# EasyEDA Pro project CH32V203 DOUBLE-FOC.epro, board PCB1
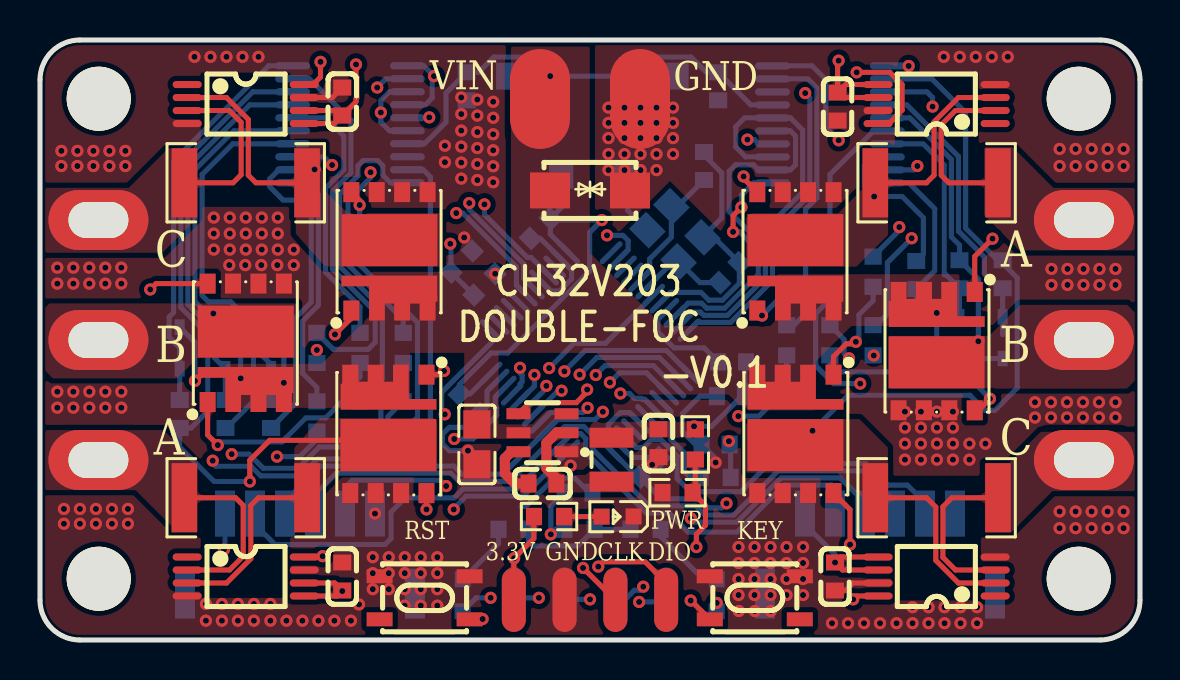
[diagram p2: board, top side]
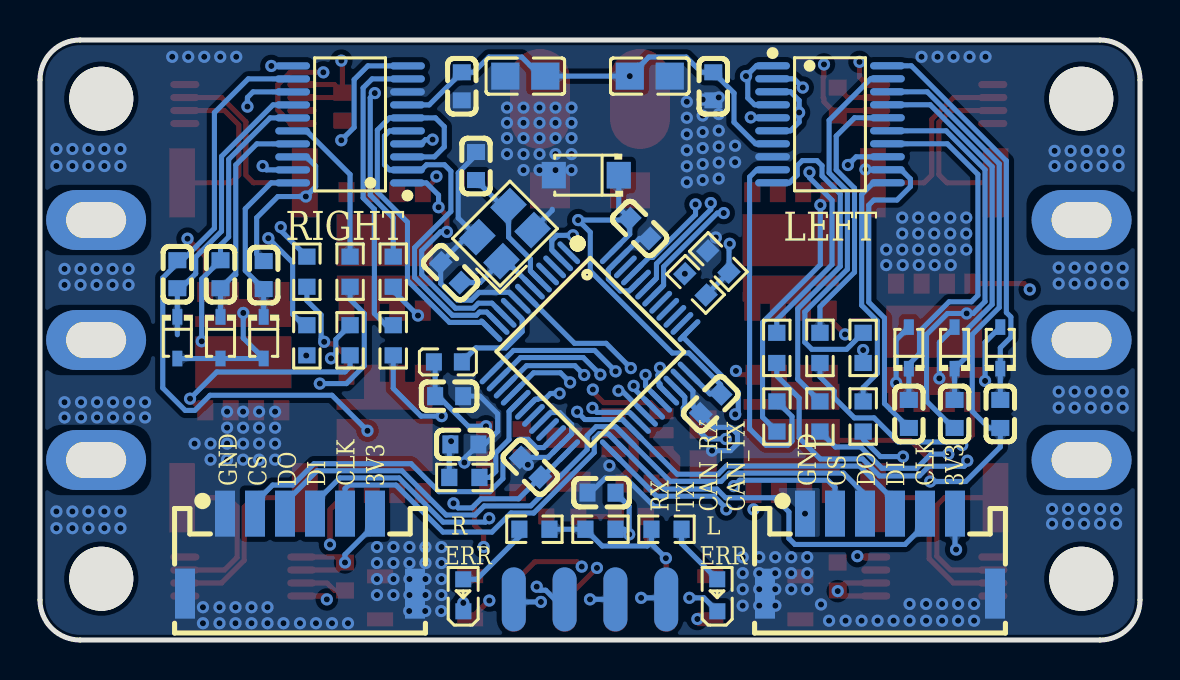
[diagram p3: board, bottom side, seen from below]

Outline 55 x 30 mm; copper layers: Top Layer, Inner1, Inner2, Bottom Layer. Coordinates in mm from the lower left corner of the outline.
Outline path: 0,28 0,2 arc(0.59,0.59) 2,0 53,0 arc(54.41,0.59) 55,2 55,28 arc(54.41,29.41) 53,30 2,30 arc(0.59,29.41) 0,28
Stack: Top Layer 0.035mm 外层铜厚1oz / Dielectric1 0.2104mm 7628 RC49% 8.6mil / Inner1 0.0152mm 内层铜厚 / Dielectric2 1.065mm 1.1mm H/HOZ Copper / Inner2 0.0152mm 内层铜厚 / Dielectric3 0.2104mm 7628 RC49% 8.6mil / Bottom Layer 0.035mm 外层铜厚1oz

## Design rules (mm)
template: 自定义配置
spacing copperThickness1oz (default): track to track 0.102, other pairs 0.152 to 0.3
spacing copperThickness2oz: track to track 0.203, other pairs 0.152 to 0.3
track width copperThickness1oz (default): min 0.127, default 0.254, max 2.54
track width copperThickness2oz: min 0.203, default 0.254, max 2.54
differential pair differentialPair (default): width min 0.127, default 0.254, max 2.54; gap min 0.152, default 0.152
via viaSize (default): diameter min 0.5, default 0.61, max 10; hole min 0.3, default 0.305, max 6.3

## Placement (name value [footprint] x y rotation side)
C1  20pF  [C0603]  33.2 23.7 90 bottom
C2  100nF  [C0603]  39.75 3.17 90 top
C3  100nF  [C0603]  34.54 12.19 0 bottom
C4  20pF  [C0603]  34.47 18.36 45 bottom
C8  100nF  [C0603]  21.46 11.81 135 bottom
C9  100nF  [C0603]  25.02 20.57 45 bottom
C10  100nF  [C0603]  30.48 8.64 225 bottom
C15  100nF  [C0603]  26.92 7.37 180 bottom
C19  100nF  [C0603]  25.12 7.82 180 top
C20  22uF  [C0603]  30.92 9.84 90 top
C21  10uF  [C0805]  21.84 9.78 90 top
C25  100nF  [C0603]  33.91 27.69 90 bottom
C26  22uF  [C0805]  24.51 28.19 0 bottom
C27  100nF  [C0603]  6.98 11.3 90 bottom
C28  100nF  [C0603]  9.27 11.3 90 bottom
C29  100nF  [C0603]  11.56 11.3 90 bottom
C30  100nF  [C0603]  21.34 27.69 90 bottom
C31  22uF  [C0805]  30.73 28.19 180 bottom
C32  100nF  [C0603]  43.81 18.25 270 bottom
C33  100nF  [C0603]  45.97 18.29 270 bottom
C34  100nF  [C0603]  48.13 18.29 270 bottom
C35  100nF  [C0603]  33.78 9.78 0 bottom
C36  100nF  [C0603]  15.11 3.17 270 top
C37  100nF  [C0603]  15.11 26.92 270 top
C38  100nF  [C0603]  39.88 26.67 90 top
CN2  -  [1x4P排针贴片]  27.5 2.03 180 bottom
CN3  -  [1x4P排针贴片]  27.5 2 0 top
CN4  -  [电源接口]  27.5 27.05 0 top
CN5  -  [无刷电机接口]  2.92 15 90 top
CN6  -  [无刷电机接口]  52.19 15 270 top
D1  SMF3.3  [SOD-123FL_L3.0-W1.9-LS3.7-FD]  27.69 23.24 180 bottom
D2  B5819WS  [SOD-323_L1.7-W1.3-LS2.5-FD]  9.27 14.61 270 bottom
D3  B5819WS  [SOD-323_L1.7-W1.3-LS2.5-FD]  11.56 14.61 270 bottom
D4  B5819WS  [SOD-323_L1.7-W1.3-LS2.5-FD]  6.98 14.61 270 bottom
D5  B5819WS  [SOD-323_L1.7-W1.3-LS2.5-FD]  43.81 15.11 90 bottom
D6  B5819WS  [SOD-323_L1.7-W1.3-LS2.5-FD]  45.97 15.11 90 bottom
D7  B5819WS  [SOD-323_L1.7-W1.3-LS2.5-FD]  48.13 15.11 90 bottom
D8  SMAJ16CA  [SMA_L4.4-W2.6-LS5.0-BI]  27.5 22.48 180 top
L1  BLM18PG121SN1D  [L0603]  34.61 13.91 180 bottom
L3  2.2uH  [IND-SMD_L2.5-W2.0_MHCHL2520]  28.57 9.02 90 top
LED1  红  [LED0603-RD_RED]  28.88 6.17 180 top
LED2  蓝  [LED0603-RD_RED]  21.13 2.24 90 bottom
LED3  蓝  [LED0603-RD_RED]  33.84 2.24 90 bottom
OSC1  CH32V203C8T6TR  [LQFP-48_L7.0-W7.0-P0.50-LS9.0-BL]  27.5 14.41 315 bottom
Q1  RUH30J51M  [DFN-8_L6.0-W5.0-P1.27_AON6938]  17.42 10.31 180 top
Q2  RUH30J51M  [DFN-8_L6.0-W5.0-P1.27_AON6938]  10.29 14.86 0 top
Q3  RUH30J51M  [DFN-8_L6.0-W5.0-P1.27_AON6938]  17.47 19.43 0 top
Q4  RUH30J51M  [DFN-8_L6.0-W5.0-P1.27_AON6938]  37.77 19.43 0 top
Q5  RUH30J51M  [DFN-8_L6.0-W5.0-P1.27_AON6938]  44.83 14.44 180 top
Q6  RUH30J51M  [DFN-8_L6.0-W5.0-P1.27_AON6938]  37.77 10.31 180 top
R1  4.7Ω  [R0603]  13.84 11.18 270 bottom
R2  4.7Ω  [R0603]  13.84 14.61 270 bottom
R3  4.7Ω  [R0603]  16 11.18 270 bottom
R4  4.7Ω  [R0603]  16 14.61 270 bottom
R5  4.7Ω  [R0603]  18.15 11.18 270 bottom
R6  4.7Ω  [R0603]  18.16 14.61 270 bottom
R11  10kΩ  [R0603]  26.98 5.54 0 bottom
R14  33.2kΩ  [R0603]  32.77 9.78 90 top
R15  10kΩ  [R0603]  31.88 7.37 0 top
R16  4.7Ω  [R0603]  41.66 14.99 270 bottom
R17  4.7Ω  [R0603]  37.34 18.42 270 bottom
R18  4.7Ω  [R0603]  39.5 14.99 270 bottom
R19  4.7Ω  [R0603]  39.5 18.42 270 bottom
R20  4.7Ω  [R0603]  37.34 14.99 270 bottom
R21  4.7Ω  [R0603]  41.66 18.42 270 bottom
R22  4.7kΩ  [R0603]  25.45 6.17 180 top
R23  4.7kΩ  [R0603]  23.68 5.54 0 bottom
R24  10kΩ  [R0603]  21.08 18.92 225 bottom
R25  100Ω  [R0603]  33.78 8.13 0 bottom
R26  33.2kΩ  [R0603]  22.22 17.78 45 bottom
R27  10mΩ  [R2512]  10.29 7.11 180 top
R28  10mΩ  [R2512]  10.29 22.86 0 top
R29  10mΩ  [R2512]  44.83 22.86 0 top
R30  10mΩ  [R2512]  44.83 7.11 180 top
R31  4.7kΩ  [R0603]  30.28 5.54 180 bottom
SCREW1  -  [M3螺丝]  3 27 0 top
SCREW2  -  [M3螺丝]  3 3 0 top
SCREW3  -  [M3螺丝]  52 27 0 top
SCREW4  -  [M3螺丝]  52 3 0 top
SW1  TS-1089S-02526  [SW-SMD_4P-L4.2-W3.3-P2.15-LS5.1]  19.23 2.11 180 top
SW2  TS-1089S-02526  [SW-SMD_4P-L4.2-W3.3-P2.15-LS5.1]  35.74 2.11 180 top
U1  INA240A2PWR  [TSSOP-8_L4.4-W3.0-P0.65-LS6.4-BL]  10.29 3.17 270 top
U2  INA240A2PWR  [TSSOP-8_L4.4-W3.0-P0.65-LS6.4-BL]  10.29 26.8 270 top
U3  ZX-ZH1.5-6PWT  [CONN-SMD_6P-P1.50_ZX-ZH1.5-6PWT]  42 4.32 180 bottom
U4  ZX-ZH1.5-6PWT  [CONN-SMD_6P-P1.50_ZX-ZH1.5-6PWT]  13 4.32 180 bottom
U5  TPS563201DDCT  [TSOT-23-6_L2.9-W1.6-P0.95-LS2.8-BL]  25.12 10.36 90 top
U6  EG2133  [TSSOP-20_L6.5-W4.4-P0.65-LS6.4-BL]  15.5 25.79 270 bottom
U7  EG2133  [TSSOP-20_L6.5-W4.4-P0.65-LS6.4-BL]  39.5 25.78 90 bottom
U8  INA240A2PWR  [TSSOP-8_L4.4-W3.0-P0.65-LS6.4-BL]  44.83 26.8 90 top
U9  INA240A2PWR  [TSSOP-8_L4.4-W3.0-P0.65-LS6.4-BL]  44.83 3.17 90 top
X4  8MHz  [CRYSTAL-SMD_4P-L3.2-W2.5-BL]  31.75 20.32 135 bottom

## Footprints (pads in the part's own frame, mm; a bottom-side part is the same pattern mirrored in y, then rotated)
1x4P排针贴片
  oval 1.2x3.2 smd: 1(3.81,0) 2(1.27,0) 3(-1.27,0) 4(-3.81,0)
C0603
  rect 0.8x0.9 smd: 1(-0.7,0) 2(0.7,0)
C0805
  rect 1.41x1.35 smd: 1(-1,0) 2(1,0)
CONN-SMD_6P-P1.50_ZX-ZH1.5-6PWT
  rect 1x2.3 smd: 1(-3.75,2) 2(-2.25,2) 3(-0.75,2) 4(0.75,2) 5(2.25,2) 6(3.75,2)
  rect 1x2.5 smd: 7(5.75,-2) 8(-5.75,-2)
CRYSTAL-SMD_4P-L3.2-W2.5-BL
  rect 1.4x1.2 smd: 1(-1.1,-0.85) 2(1.1,-0.85) 3(1.1,0.85) 4(-1.1,0.85)
DFN-8_L6.0-W5.0-P1.27_AON6938
  rect 0.8x1 smd: 1(-1.905,-2.96) 3(1.905,2.96) 4(0.635,2.96) 5(-0.635,2.96) 6(-1.905,2.96)
  custom 4.8x2.25 smd: 2(-0.005,-1.91)
  rect 4.8x2.6 smd: 7(0,0.56)
IND-SMD_L2.5-W2.0_MHCHL2520
  rect 1x2.2 smd: 1(-1.1,0) 2(1.1,0)
L0603
  rect 0.8x0.864 smd: 1(-0.7,0) 2(0.7,0)
LED0603-RD_RED
  rect 0.8x0.8 smd: 1(-0.799,-0.004) 2(0.799,0.004)
LQFP-48_L7.0-W7.0-P0.50-LS9.0-BL
  oval 0.27x1.5 smd: 1(-2.75,-4.25) 2(-2.25,-4.25) 3(-1.75,-4.25) 4(-1.25,-4.25) 5(-0.75,-4.25) 6(-0.25,-4.25) 7(0.25,-4.25) 8(0.75,-4.25) 9(1.25,-4.25) 10(1.75,-4.25) 11(2.25,-4.25) 12(2.75,-4.25) 25(2.75,4.25) 26(2.25,4.25) 27(1.75,4.25) 28(1.25,4.25) 29(0.75,4.25) 30(0.25,4.25) 31(-0.25,4.25) 32(-0.75,4.25) 33(-1.25,4.25) 34(-1.75,4.25) 35(-2.25,4.25) 36(-2.75,4.25)
  oval 1.5x0.27 smd: 13(4.25,-2.75) 14(4.25,-2.25) 15(4.25,-1.75) 16(4.25,-1.25) 17(4.25,-0.75) 18(4.25,-0.25) 19(4.25,0.25) 20(4.25,0.75) 21(4.25,1.25) 22(4.25,1.75) 23(4.25,2.25) 24(4.25,2.75) 37(-4.25,2.75) 38(-4.25,2.25) 39(-4.25,1.75) 40(-4.25,1.25) 41(-4.25,0.75) 42(-4.25,0.25) 43(-4.25,-0.25) 44(-4.25,-0.75) 45(-4.25,-1.25) 46(-4.25,-1.75) 47(-4.25,-2.25) 48(-4.25,-2.75)
M3螺丝
  round 3.2 hole 3.2: 1(-0.064,0.064)
R0603
  rect 0.806x0.864 smd: 1(-0.753,0) 2(0.753,0)
R2512
  rect 1.282x3.456 smd: 1(-3.067,0) 2(3.067,0)
SMA_L4.4-W2.6-LS5.0-BI
  rect 2x1.8 smd: 1(-2,0) 2(2,0)
SOD-123FL_L3.0-W1.9-LS3.7-FD
  rect 1.208x1.33 smd: 1(-1.624,0) 2(1.624,0)
SOD-323_L1.7-W1.3-LS2.5-FD
  rect 0.78x0.5 smd: 1(-1.04,0) 2(1.04,0)
SW-SMD_4P-L4.2-W3.3-P2.15-LS5.1
  rect 1.3x0.7 smd: 1(-2.25,1.075) 2(2.25,1.075) 3(-2.25,-1.075) 4(2.25,-1.075)
TSOT-23-6_L2.9-W1.6-P0.95-LS2.8-BL
  rect 0.55x1.2 smd: 1(-0.95,-1.2) 2(0,-1.2) 3(0.95,-1.2) 4(0.95,1.2) 5(0,1.2) 6(-0.95,1.2)
TSSOP-8_L4.4-W3.0-P0.65-LS6.4-BL
  oval 0.353x1.454 smd: 1(-0.975,-2.927) 2(-0.325,-2.927) 3(0.325,-2.927) 4(0.975,-2.927) 5(0.975,2.927) 6(0.325,2.927) 7(-0.325,2.927) 8(-0.975,2.927)
TSSOP-20_L6.5-W4.4-P0.65-LS6.4-BL
  oval 0.364x1.742 smd: 1(-2.925,-2.871) 2(-2.275,-2.871) 3(-1.625,-2.871) 4(-0.975,-2.871) 5(-0.325,-2.871) 6(0.325,-2.871) 7(0.975,-2.871) 8(1.625,-2.871) 9(2.275,-2.871) 10(2.925,-2.871) 11(2.925,2.871) 12(2.275,2.871) 13(1.625,2.871) 14(0.975,2.871) 15(0.325,2.871) 16(-0.325,2.871) 17(-0.975,2.871) 18(-1.625,2.871) 19(-2.275,2.871) 20(-2.925,2.871)
无刷电机接口
  rrect 3x5 hole 1.8x3: 1(-6,0) 2(0,0) 3(6,0)
电源接口
  rrect 3x5 smd: 1(-2.5,0) 2(2.5,0)

## Nets
As in the schematic.

Pads without a net: OSC1 1 3 4 19 21 38 39 40 41 46; SCREW1 1; SCREW2 1; SCREW3 1; SCREW4 1; SW1 2; SW2 1; U1 1; U2 1; U8 1; U9 1

## Via types
v1: diameter 0.61, hole 0.305, Top Layer to Bottom Layer, 351 vias

## Routing (per net, layer and track width the routed paths; a pad name or vN(x,y) marks a point on that pad's centre or on a via; arc(x,y) is an arc through that point)
3.3V: length 171.2
  Top Layer w0.254: U8.5 40.28,27.77 C38.2 ; C36.2 14.74,2.85 U1.6 ; C36.2 14.84,2.2 U1.5 ; C36.2 15.18,2.41 15.15,2.41 v1(15.11,2.45) ; C38.2 40.12,27.12 U8.6 ; C38.2 39.88,28.92 v1(39.93,28.97) ; U9.5 40.03,4.15 v1(39.75,3.88) 40.13,3.5 U9.6 ; v1(15.8,28.78) 15.8,28.18 15.84,28.14 15.84,27.11 15.8,27.07 15.8,26.91 C37.2 ; C37.2 14.71,25.82 U2.5 ; C37.2 14.87,26.47 U2.6 ; 24.45,6.17 24.69,5.93 24.69,5.07 v1(23.71,4.09) 23.69,4.07 CN3.4 ; R14.2 32.77,10.62 v1(32.7,10.69)
  Inner1 w0.254: v1(28.09,21) 30.01,22.91 31.07,22.91 31.47,23.32 32.34,23.32 37.31,28.28 39.25,28.28 v1(39.93,28.97) 39.49,29.41 16.44,29.41 v1(15.8,28.78) ; 14.31,3.25 12.76,3.25 11.49,4.52 v1(9.2,4.52) ; 14.31,3.25 14.52,3.25 15.07,3.8 15.07,4.9 15.33,5.16 22.64,5.16 v1(23.71,4.09) ; 14.31,3.25 v1(15.11,2.45) ; v1(34.33,6.83) 34.37,6.87 34.37,9.12 32.93,10.55 35.81,10.55 39.75,6.61 v1(39.75,3.88)
  Inner2 w0.254: v1(23.71,4.09) 24.24,4.62 28.62,4.62 32.7,8.7 v1(32.7,10.69) 32.7,11.05 27.73,16.02 27.73,20.63 v1(28.09,21)
  Bottom Layer w0.254: OSC1.48 25.51,20.29 C9.2 ; C9.2 26.06,21.62 D1.2 ; C9.2 25.59,21 v1(28.09,21) 27.49,20.39 27.49,18.45 23.39,14.35 22.56,14.35 20.97,12.76 C8.2 21.5,12.31 OSC1.36 ; v1(32.7,10.69) 33.58,10.69 35.09,12.19 C3.2 35.24,13.84 L1.1 ; U4.6 9.25,4.57 v1(9.2,4.52) ; R23.2 24.43,4.91 ; 24.43,4.91 24.43,4.81 v1(23.71,4.09) ; 24.43,4.91 24.64,4.7 26.89,4.7 R11.2 R31.2 ; 38.25,6.95 38.25,5.77 39.75,4.27 v1(39.75,3.88) ; OSC1.24 29.88,8.14 29.99,8.14 31.06,7.06 32.95,7.06 33.4,6.61 34.1,6.61 v1(34.33,6.83)
GND: length 45.6
  Top Layer w0.254: C37.1 14.61,27.12 U2.7 ; C2.1 40.28,2.47 40.65,2.85 U9.7
  Bottom Layer w0.254: 29.97,10.88 29.48,11.37 29.01,11.37 28.42,10.78 28.42,10.3 28.9,9.82 OSC1.23 29.6,9.13 30.97,9.13 ; 25.03,17.95 25.05,17.95 25.55,17.45 25.99,17.45 26.58,18.05 26.58,18.51 26.09,19.01 25.02,20.08 C9.1 ; C3.1 33,12.19 32.12,11.31 32.12,10.43 32.77,9.78 C35.1 33.71,9.15 33.71,8.97 ; 24.06,6.68 24.29,6.68 25.71,8.09 26.74,8.09 27.47,7.37 C15.1 ; C1.2 33.2,24.24 34.09,23.35 34.09,21.1 X4.4 33.68,20.14 C4.2 34.97,17.83 34.13,16.99 33.44,16.99 33.04,17.38 31.53,17.38 OSC1.8 ; v1(21.4,9.47) 20.47,9.47 20.13,9.81 20.13,10.29 20.47,10.63 21.28,10.63 C8.1 21.98,11.32 22.35,11.68 22.35,12.45 OSC1.35 ; X4.2 29.39,21.48 29.39,21.54
  vias: v1(0.87,18.62) v1(0.87,17.82) v1(0.87,12.42) v1(0.87,11.62) v1(1.07,24.46) v1(1.07,23.7) v1(1.2,6.55) v1(1.2,5.81) v1(1.67,18.62) v1(1.67,17.82) v1(1.67,12.42) v1(1.67,11.62) v1(1.87,24.46) v1(1.87,23.7) v1(2,6.55) v1(2,5.81) v1(2.47,18.62) v1(2.47,17.82) v1(2.47,12.42) v1(2.47,11.62) v1(2.67,24.46) v1(2.67,23.7) v1(2.8,6.55) v1(2.8,5.81) v1(3.27,18.62) v1(3.27,17.82) v1(3.27,12.42) v1(3.27,11.62) v1(3.47,24.46) v1(3.47,23.7) v1(3.6,6.55) v1(3.6,5.81) v1(4.07,18.62) v1(4.07,17.82) v1(4.07,12.42) v1(4.07,11.62) v1(4.27,24.46) v1(4.27,23.7) v1(4.4,6.55) v1(4.4,5.81) v1(7.72,29.16) v1(8.29,1.8) v1(8.29,0.97) v1(8.52,29.16) v1(8.69,21.12) v1(8.69,20.32) v1(8.69,19.52) v1(9.09,1.8) v1(9.09,0.97) v1(9.32,29.16) v1(9.49,21.12) v1(9.49,20.32) v1(9.49,19.52) v1(9.46,18.75) v1(9.9,1.8) v1(9.9,0.97) v1(10.12,29.16) v1(10.29,21.12) v1(10.29,20.32) v1(10.29,19.52) v1(10.26,18.75) v1(10.69,1.8) v1(10.69,0.97) v1(10.92,29.16) v1(11.09,21.12) v1(11.09,20.32) v1(11.09,19.52) v1(11.06,18.75) v1(11.52,1.8) v1(11.52,0.97) v1(11.89,21.12) v1(11.89,20.32) v1(11.89,19.52) v1(11.86,18.75) v1(12.32,0.97) v1(12.69,19.52) v1(12.69,18.75) v1(13.12,0.97) v1(13.92,0.97) v1(14.72,0.97) v1(15.55,0.97) v1(15.95,1.78) v1(16.64,4.14) v1(16.64,3.34) v1(16.64,2.54) v1(16.75,6.32) v1(17.44,4.14) v1(17.44,3.34) v1(17.44,2.54) v1(18.24,4.14) v1(18.24,3.34) v1(18.24,2.54) v1(18.23,1.72) v1(19.04,4.14) v1(19.04,3.34) v1(19.04,2.54) v1(19.04,1.72) v1(19.87,4.14) v1(19.87,3.34) v1(19.87,2.54) v1(19.87,1.72) v1(20.25,24.71) v1(20.25,23.89) v1(21.06,27.13) v1(21.06,26.3) v1(21.06,25.47) v1(21.06,24.67) v1(21.06,23.87) v1(21.06,23.07) v1(21.21,20.13) v1(21.87,27.02) v1(21.87,26.22) v1(21.87,25.4) v1(21.87,24.6) v1(21.87,23.8) v1(21.87,23) v1(22.66,26.91) v1(22.66,26.11) v1(22.66,25.29) v1(22.66,24.49) v1(22.66,23.69) v1(22.66,22.89) v1(26.53,8.72) v1(28.43,26.62) v1(28.43,25.86) v1(28.43,25.1) v1(28.43,24.3) v1(28.43,23.5) v1(29.22,26.62) v1(29.22,25.86) v1(29.22,25.1) v1(29.22,24.3) v1(29.22,23.5) v1(30.03,26.62) v1(30.03,25.86) v1(30.03,25.1) v1(30.03,24.3) v1(30.03,23.5) v1(30.61,8.76) v1(30.82,26.62) v1(30.82,25.86) v1(30.82,25.1) v1(30.82,24.3) v1(30.82,23.5) v1(31.65,26.62) v1(31.65,25.86) v1(31.65,25.1) v1(31.65,24.3) v1(33.78,8.87) v1(34.93,4.65) v1(34.93,3.85) v1(34.93,3.05) v1(34.93,2.25) v1(34.94,1.45) v1(35.73,4.65) v1(35.73,3.85) v1(35.73,3.05) v1(35.73,2.25) v1(35.74,1.45) v1(36.53,4.65) v1(36.53,3.85) v1(36.53,3.05) v1(36.53,2.25) v1(36.54,1.45) v1(37.33,4.65) v1(37.33,3.85) v1(37.33,3.05) v1(37.33,2.25) v1(38.15,4.65) v1(38.15,3.85) v1(38.15,3.05) v1(38.15,2.25) v1(39.6,0.84) v1(40.4,0.84) v1(41.2,0.84) v1(42,0.84) v1(42.83,0.84) v1(43.25,11.42) v1(43.25,10.62) v1(43.25,9.82) v1(43.25,9.02) v1(43.63,1.64) v1(43.63,0.84) v1(44.05,11.42) v1(44.05,10.62) v1(44.05,9.82) v1(44.05,9.02) v1(44.43,1.64) v1(44.43,0.84) v1(44.85,11.42) v1(44.85,10.62) v1(44.85,9.82) v1(44.85,9.02) v1(45.19,29.16) v1(45.23,1.64) v1(45.23,0.84) v1(45.65,11.42) v1(45.65,10.62) v1(45.65,9.82) v1(45.65,9.02) v1(45.99,29.16) v1(46.03,1.64) v1(46.03,0.84) v1(46.47,9.82) v1(46.47,9.02) v1(46.79,29.16) v1(46.85,1.64) v1(46.85,0.84) v1(47.27,9.82) v1(47.59,29.16) v1(48.39,29.16) v1(49.75,11.89) v1(49.75,11.13) v1(50.55,11.89) v1(50.55,11.13) v1(50.57,18.55) v1(50.57,17.75) v1(50.98,24.55) v1(50.98,23.7) v1(50.98,6.43) v1(50.98,5.59) v1(51.35,11.89) v1(51.35,11.13) v1(51.37,18.55) v1(51.37,17.75) v1(51.78,24.55) v1(51.78,23.7) v1(51.78,6.43) v1(51.78,5.59) v1(52.15,11.89) v1(52.15,11.13) v1(52.17,18.55) v1(52.17,17.75) v1(52.58,24.55) v1(52.58,23.7) v1(52.58,6.43) v1(52.58,5.59) v1(52.95,11.89) v1(52.95,11.13) v1(52.97,18.55) v1(52.97,17.75) v1(53.38,24.55) v1(53.38,23.7) v1(53.38,6.43) v1(53.38,5.59) v1(53.77,18.55) v1(53.77,17.75) v1(53.77,11.89) v1(53.77,11.13) v1(54.18,24.55) v1(54.18,23.7) v1(54.18,6.43) v1(54.18,5.59)
VIN: length 41.5
  Top Layer w0.254: Q2.2 9.9,13.33 8.13,13.33 v1(7.75,12.95)
  Bottom Layer w0.254: U6.7 19.22,24.81 20.3,25.89 20.3,27.35 C30.2 21.93,28.39 22.69,29.15 24.56,29.15 v1(25.51,28.19) C31.2 29.96,28.19 30.91,29.15 32.55,29.15 33.32,28.39 C25.2 35.54,26.76 U7.7 ; v1(7.75,12.95) 7.75,14.88 6.98,15.64 ; v1(44.84,16.35) 44.84,15.09 D5.1 D6.1 D7.1 ; 9.27,15.64 10.03,14.88 v1(10.03,13.08) ; 11.56,15.64 12.19,15.01 v1(12.19,12.86)
  vias: v1(22.76,18.31)
BAT_ADC: length 4.9
  Bottom Layer w0.254: OSC1.17 31.55,11.42 31.55,10.02 32.21,9.36 32.21,8.43 32.51,8.13 R25.1
CAN_RX: length 16.9
  Inner1 w0.254: 27.49,2.11 27.84,2.11 28.87,3.14 28.87,4.4 24.36,8.92 24.36,12.89 v1(24.72,13.25)
  Bottom Layer w0.254: v1(27.5,2.03) CN2.2 ; OSC1.32 24.72,12.7 v1(24.72,13.25)
CAN_TX: length 19
  Inner1 w0.254: v1(24,13.61) 24,8.77 28.51,4.25 28.51,3.45 27.69,2.62 25.45,2.62 v1(24.94,2.11)
  Bottom Layer w0.254: 23.61,12.29 24,12.68 24,12.8 24.11,12.91 24.11,13.25 24,13.36 v1(24,13.61) ; v1(24.94,2.11) 23.77,2.11 CN2.1
KEY: length 16.7
  Top Layer w0.254: v1(32.53,1.97) 32.55,1.97 SW2.2
  Inner1 w0.254: v1(27.38,11.61) 27.38,11.3 27.86,10.83 29.49,10.83 31.96,8.36 31.96,4.69 32.53,4.11 v1(32.53,1.97)
  Bottom Layer w0.254: v1(27.38,11.61) 27.15,11.38 25.53,11.38 25.03,10.88
L_CS: length 15
  Inner1 w0.254: v1(20.69,6.53) 20.69,7.32 v1(20.31,7.7)
  Bottom Layer w0.254: v1(20.69,6.53) 20.69,6.58 21.3,7.19 24.17,7.19 OSC1.25 ; v1(20.31,7.7) 20.02,7.99 15.61,7.99 15.25,7.63 U4.2
L_HO1: length 19.5
  Bottom Layer w0.254: U6.19 13.47,28.06 15.54,25.98 15.54,23.36 14.63,22.44 14.63,18.53 16.76,16.41 16.76,14.89 16.41,14.53 14.67,14.53 R2.1
L_HO2: length 13.9
  Bottom Layer w0.254: 16,15.36 16,16.66 14.27,18.39 14.27,22.59 15.19,23.51 15.19,25.2 14.28,26.11 U6.16
L_HO3: length 13.9
  Inner1 w0.254: v1(16.53,23.39) 16.16,23.75 v1(14.6,23.75)
  Bottom Layer w0.254: R6.1 18.16,16.01 15.4,18.77 15.4,21.99 16.53,23.12 v1(16.53,23.39) ; U6.13 14.19,24.16 v1(14.6,23.75)
L_IA: length 29.2
  Top Layer w0.254: U1.8 14.09,4.15 v1(14.13,4.19)
  Inner1 w0.254: v1(26.22,13.43) 26.22,13.79 25.07,14.94 22.51,14.94 20.44,12.87 16.4,12.87 14.13,10.6 v1(14.13,4.19)
  Bottom Layer w0.254: v1(26.22,13.43) 27.27,14.48 31.32,14.48 OSC1.13
L_IC: length 29.7
  Top Layer w0.254: v1(14.03,28.91) 14.03,28.15 13.65,27.77 U2.8
  Inner1 w0.254: v1(14.03,28.91) 16.46,26.47 16.46,25.2 18.93,22.73 18.93,20.06 23.63,15.36 25.38,15.36 26.98,13.76 v1(26.98,13.27)
  Bottom Layer w0.254: v1(26.98,13.27) 27.84,14.12 30.97,14.12 32.1,13
L_IN1: length 17.6
  Inner1 w0.254: v1(22.22,21.78) 22.22,21.91 21.7,22.43 20.74,22.43 19.23,23.94 19.23,25.07 20.05,25.89 20.05,27.85 v1(19.7,28.19)
  Bottom Layer w0.254: OSC1.45 24.55,19.13 24.36,19.13 22.22,21.27 v1(22.22,21.78) ; U6.1 19.18,28.71 v1(19.7,28.19) 19.61,28.11 19.61,27.1 19.27,26.76 18.37,26.76
L_IN2: length 18.1
  Inner1 w0.254: 17.79,26.46 16.86,27.38 v1(16.86,27.62) ; v1(21.46,21.85) 21.38,21.93 20.73,21.93 17.79,24.88 17.79,26.38 17.87,26.38 18.11,26.13 v1(19.46,26.13)
  Bottom Layer w0.254: v1(19.46,26.13) 19.44,26.11 U6.5 ; v1(21.46,21.85) 21.46,21.53 24.18,18.81 24.18,18.09 24.67,17.59 ; U6.2 17.3,28.06 v1(16.86,27.62)
L_IN3: length 16.4
  Inner1 w0.254: v1(20.81,21.35) 17.04,25.12 v1(17.04,26.38)
  Bottom Layer w0.254: OSC1.42 23.82,17.74 23.82,18.66 21.13,21.35 v1(20.81,21.35) ; U6.6 17.47,25.46 17.04,25.89 v1(17.04,26.38) 17.04,26.98 17.47,27.41 U6.3
L_LED: length 31.1
  Inner2 w0.254: v1(22.53,2.11) 23.93,3.5 23.95,3.5 24.71,4.26 28.77,4.26 33.15,8.64 33.15,10.31 33.4,10.56 33.4,10.92 28.35,15.97 v1(28.35,20.23)
  Bottom Layer w0.254: v1(22.53,2.11) 21.8,2.11 LED2.1 ; 28.91,19.01 29.41,19.5 29.41,19.97 29.14,20.23 v1(28.35,20.23)
L_LO1: length 12.5
  Bottom Layer w0.254: R1.1 13.84,12.62 13.13,13.33 13.13,15.95 13.92,16.74 13.92,22.28 13.33,22.86 U6.11
L_LO2: length 16.8
  Bottom Layer w0.254: U6.10 17.53,22.86 17.14,23.25 17.14,23.72 16.88,23.97 16.15,23.97 15.9,23.72 15.9,23.21 14.99,22.3 14.99,18.68 17.11,16.55 17.11,13.04 R3.1
L_LO3: length 18.7
  Bottom Layer w0.254: R5.1 17.4,11.18 17.4,9.95 17.6,9.74 18.7,9.74 19.52,10.56 19.52,23.15 19.16,23.51 U6.9
L_VB1: length 19.8
  Bottom Layer w0.254: U6.20 11.43,28.71 6.68,23.96 6.68,16.38 6.46,16.15 6.46,15.14 6.98,14.61 6.98,13.78 ; 6.98,12.13 D4.2
L_VB2: length 19
  Bottom Layer w0.254: C28.2 D2.2 8.74,14.09 8.74,15.43 7.39,16.78 7.39,23.66 10.49,26.76 12.63,26.76
L_VB3: length 18.2
  Bottom Layer w0.254: U6.14 9.64,24.81 8.1,23.28 8.1,17.23 8.43,16.91 9.54,16.91 11.03,15.43 11.03,14.31 11.56,13.78 ; 11.56,12.13 D3.2
L_VS1_N: length 8.7
  Top Layer w0.254: R27.2 9.78,7.11 10.16,6.73 10.16,4.19 9.47,3.5 U1.2
L_VS1_P: length 42.3
  Top Layer w0.254: 15.04,9.98 11.48,9.98 10.49,8.99 v1(10.49,7.92) ; R27.1 10.92,7.11 10.54,6.73 10.54,4.06 9.33,2.85 U1.3
  Bottom Layer w0.254: v1(10.49,7.92) 8.71,7.92 6.98,9.65 C27.1 7.56,10.6 8.39,11.43 8.39,15.28 7.04,16.63 7.04,23.81 10.64,27.41 U6.18
L_VS2: length 21.2
  Bottom Layer w0.254: U6.15 9.69,25.46 7.75,23.52 7.75,16.92 8.34,16.33 v1(8.67,16.33) 9.62,16.33 10.67,15.28 10.67,11.94 9.33,10.6 C28.1
L_VS3_N: length 8.6
  Top Layer w0.254: R28.1 9.65,22.86 10.06,23.27 10.06,25.88 9.47,26.47 U2.3
L_VS3_P: length 26.7
  Top Layer w0.254: U2.2 9.32,27.12 10.41,26.03 10.41,23.24 10.79,22.86 R28.2
  Bottom Layer w0.254: C29.1 12.78,11.82 12.78,16.1 13.56,16.89 13.56,21.74 13.31,22 12.15,22 11.48,22.67 11.48,23.05 11.94,23.51 U6.12 13.71,23.51 v1(13.73,23.53)
MISO: length 36.1
  Bottom Layer w0.254: U4.3 13.88,6.44 13.88,7.4 14.82,8.34 20.54,8.34 20.94,7.94 23.5,7.94 26.23,10.67 27.19,10.67 27.64,10.22 27.64,9.52 30.46,6.7 32.79,6.7 33.25,6.25 34.69,6.25 36.9,8.46 41.15,8.46 42.75,6.86 U3.3
MOSI: length 37.4
  Inner1 w0.254: v1(32.54,6.09) 32.54,8.28 29.64,11.18 28.37,11.18 v1(28.14,11.41)
  Bottom Layer w0.254: U4.4 12.25,6.93 14.02,8.7 20.68,8.7 21.09,8.29 23.15,8.29 OSC1.28 25.88,11.02 27.76,11.02 v1(28.14,11.41) ; v1(32.54,6.09) 32.73,5.89 34.84,5.89 37.05,8.1 40.01,8.1 41.25,6.86 U3.4
NRST: length 36.4
  Top Layer w0.254: SW1.1 21.5,1.05 v1(22.13,1.05)
  Inner2 w0.254: v1(22.13,1.05) 21.88,1.3 21.88,3.27 23.58,4.98 25.23,4.98 v1(25.54,5.28) 28.78,5.28 32.06,8.56 32.06,11.19 28.56,14.68 26.54,14.68 v1(25.46,13.6)
  Bottom Layer w0.254: OSC1.7 28.27,14.83 26.7,14.83 v1(25.46,13.6) ; R11.1 25.79,5.54 v1(25.54,5.28) 25.54,6.68 C15.2
OSC_IN: length 6.6
  Bottom Layer w0.254: 29.97,17.95 30.48,18.45 30.48,19.05 31.57,20.14 31.57,21.69 31.57,21.7 31.9,21.7 C1.1
OSC_OUT: length 4.5
  Bottom Layer w0.254: 30.33,17.59 31.38,18.64 31.63,18.64 31.75,18.76 32.11,18.76 33,17.87 C4.1
PA0: length 17.2
  Top Layer w0.254: v1(35.07,21.64) 34.65,21.22 v1(34.65,20.41)
  Inner1 w0.254: v1(35.07,21.64) 34.59,22.12 34.59,24.31 35.31,25.02 v1(35.37,25.02)
  Bottom Layer w0.254: v1(35.07,21.64) 35.07,22.25 35.68,22.86 U7.1 ; v1(35.37,25.02) 35.72,25.02 35.94,24.81 U7.4 ; v1(34.65,20.41) 34.98,20.41 35.91,19.47 35.91,18.28 34.23,16.59 33.33,16.59 33.08,16.84 32.4,16.84 OSC1.10
PA1: length 17.7
  Bottom Layer w0.254: U7.5 37.52,25.46 37.78,25.2 37.78,23.76 37.52,23.51 U7.2 35.93,23.51 35.67,23.76 34.78,23.76 34.46,23.44 34.46,21.43 36.27,19.61 36.27,18.13 34.38,16.23 33.18,16.23 33.02,16.4 32.66,16.4 OSC1.11
PA2: length 20.3
  Bottom Layer w0.254: 32.93,15.95 OSC1.12 ; U7.3 35.28,24.16 34.79,24.65 34.79,25.67 35.23,26.11 U7.6 37.52,26.11 38.13,25.5 38.13,22.4 36.63,20.89 36.63,17.98 34.53,15.88 32.85,15.88
PA5: length 41.6
  Top Layer w0.254: U8.8 42.45,25.82 42.91,26.28 42.91,26.3 43.11,26.49 43.11,27.77 42.49,28.38 v1(40.83,28.38)
  Inner1 w0.254: v1(40.83,28.38) 44.5,24.72 44.5,23.01 42.27,20.78 42.27,13.97 41.76,13.46 27.92,13.46 27.79,13.33 v1(27.79,13.25)
  Bottom Layer w0.254: v1(27.79,13.25) 28.25,13.72 30.67,13.72 OSC1.15
PA6: length 24.6
  Top Layer w0.254: U9.8 40.83,2.2 v1(40.66,2.03)
  Inner1 w0.254: v1(40.66,2.03) 41.08,2.46 41.08,6.28 34.46,12.91 28.72,12.91 28.69,12.88 v1(28.49,12.88)
  Bottom Layer w0.254: 31.39,12.29 30.32,13.36 28.98,13.36 v1(28.49,12.88)
PA9: length 15.5
  Inner1 w0.254: v1(30.16,2.67) 29.58,3.25 29.58,4.7 25.07,9.21 25.07,11.38 26.08,12.39 v1(26.08,12.47)
  Bottom Layer w0.254: v1(26.08,12.47) 25.91,12.47 OSC1.30 ; v1(30.16,2.67) 29.99,2.49 29.71,2.49 29.23,2 ; 28.72,2.03 CN2.3
PA10: length 16.6
  Inner1 w0.254: v1(29.96,1.9) 29.23,2.63 29.23,4.55 24.71,9.06 24.71,12.1 v1(25.32,12.71)
  Bottom Layer w0.254: OSC1.31 25.32,12.58 v1(25.32,12.71) ; 31.31,2.86 CN2.4 ; v1(29.96,1.9) 30.96,1.9
PA13-SWDIO: length 19.4
  Top Layer w0.254: 31.31,2.86 30.25,3.91 28.15,3.91 v1(27.91,3.67) ; 30.96,1.9 31.31,2.26
  Inner1 w0.254: v1(27.91,3.67) 27.39,4.19 25.19,4.19 20.71,8.67 v1(20.71,10.05)
  Bottom Layer w0.254: OSC1.34 22.76,12.15 22.76,11.69 22.84,11.61 22.84,11.24 21.65,10.05 v1(20.71,10.05)
PA14-SWCLK: length 20
  Top Layer w0.254: 29.23,2 CN3.2 ; v1(27.15,3.6) 28.72,2.03
  Inner1 w0.254: v1(20.24,11.28) 20.1,11.14 20.1,8.78 25.27,3.6 v1(27.15,3.6)
  Bottom Layer w0.254: OSC1.37 22.86,15.16 20.09,12.39 20.09,11.43 v1(20.24,11.28)
PB0: length 15.1
  Inner1 w0.254: v1(29.02,12.33) 29.5,12.33 33.58,8.25 33.58,2.11 v1(33.84,1.85)
  Bottom Layer w0.254: OSC1.18 30.23,12.04 30.11,12.04 30.06,12.08 29.72,12.08 29.48,12.33 v1(29.02,12.33) ; v1(33.84,1.85) 33.84,1.44 LED3.1
PB11: length 19.1
  Bottom Layer w0.254: U3.2 44.25,6.86 43.37,7.75 42.37,7.75 41.3,8.81 36.45,8.81 35.05,7.42 32.51,7.42 31.85,8.07 31.85,9.21 31.03,10.03 30.59,10.03 30.18,9.62 29.82,9.62 OSC1.22
PB13: length 37.1
  Bottom Layer w0.254: U3.5 39.75,7.57 39.57,7.75 37.2,7.75 34.85,5.4 32.4,5.4 31.45,6.35 30.31,6.35 27.29,9.37 27.29,10.07 27.05,10.31 26.57,10.31 ; OSC1.26 23.82,7.55 21.15,7.55 20.72,7.11 18.26,7.11 17.55,6.4 17.55,5.08 17.25,4.78 11.75,4.78 10.75,5.77 U4.5
R_HO1: length 17.5
  Inner1 w0.254: v1(38.26,27.34) 38.31,27.39 39.66,27.39 43.36,23.7 v1(43.87,23.7)
  Bottom Layer w0.254: v1(38.26,27.34) 38.49,27.12 38.49,22.25 37.34,21.1 R17.1 ; U7.19 43.68,23.51 v1(43.87,23.7)
R_HO2: length 7.9
  Bottom Layer w0.254: U7.16 41.68,25.46 39.5,23.28 R19.1
R_HO3: length 12
  Inner1 w0.254: v1(42.96,20.64) 43.31,20.64 44.86,22.19 44.86,26.44 v1(44.63,26.67)
  Bottom Layer w0.254: U7.13 44.35,27.41 44.63,27.13 v1(44.63,26.67) ; v1(42.96,20.64) 42.96,20.48 R21.1
R_LO1: length 16.3
  Inner1 w0.254: v1(43.58,20.09) 45.21,21.72 45.21,26.91 43.43,28.69 v1(43.43,28.7)
  Bottom Layer w0.254: U7.11 43.18,28.71 43.18,28.7 v1(43.43,28.7) ; 41.66,15.72 41.8,15.72 42.37,16.29 42.37,18.87 v1(43.58,20.09)
R_LO2: length 19.4
  Inner1 w0.254: v1(39.94,24.99) 40.2,24.73 40.2,14.34 v1(40.45,14.08)
  Bottom Layer w0.254: v1(39.94,24.99) 39.29,25.63 39.29,28.02 38.61,28.71 U7.10 ; v1(40.45,14.08) 40.21,14.32 40.21,15.03 R18.1
R_LO3: length 15.1
  Bottom Layer w0.254: R20.1 37.7,15.74 38.28,16.32 38.28,21.54 38.84,22.1 38.84,27.61 38.39,28.06 U7.9
R_VB1: length 8.7
  Bottom Layer w0.254: U7.20 43.44,22.86 44.74,21.56 44.74,18.47 C32.2 D5.2
R_VB2: length 11.2
  Bottom Layer w0.254: U7.17 44.16,24.81 45.21,23.75 45.21,18.27 45.3,18.27 C33.2 D6.2
R_VB3: length 14.5
  Bottom Layer w0.254: 48.13,15.26 48.13,17.4 47.21,18.32 47.21,19.15 45.92,20.44 45.92,24.18 43.35,26.76 U7.14
R_VS1_N: length 8.5
  Top Layer w0.254: 47.76,26.47 45.77,26.47 45.06,25.76 45.06,23.24 45.44,22.86 R29.2
R_VS1_P: length 17.6
  Top Layer w0.254: R29.1 44.32,22.86 44.7,23.24 44.7,25.91 45.92,27.12 U8.3
  Bottom Layer w0.254: 43.81,18.95 44.17,19.3 44.17,21.11 43.11,22.17 v1(41.71,22.17) 41.22,22.67 41.22,23.7 41.68,24.16 U7.18
R_VS2: length 13.7
  Bottom Layer w0.254: v1(46.92,14.94) 46.92,18.05 C33.1 45.97,19.75 45.57,20.15 45.57,24.03 43.49,26.11 U7.15
R_VS3_N: length 8.3
  Top Layer w0.254: R30.1 45.59,7.11 45.15,6.67 45.15,4.13 45.78,3.5 U9.3
R_VS3_P: length 40.8
  Top Layer w0.254: R30.2 44.32,7.11 44.79,6.64 44.79,3.98 45.92,2.85 U9.2
  Bottom Layer w0.254: C34.1 48.13,18.83 48.86,18.1 48.86,12.6 47.74,11.48 47.26,11.48 46.5,12.24 40.4,12.24 v1(38.63,10.46) ; 48.13,18.73 46.28,20.58 46.28,26.36 44.59,28.06 U7.12
$1N1738: length 5.1
  Bottom Layer w0.254: L1.2 33.21,14.61 31.7,14.61 30.89,15.41 30.89,16.03 31.39,16.53 31.39,16.53 ; 33.91,13.78 33.84,13.84
$1N2066: length 3.5
  Top Layer w0.508: C19.1 25.82,8.08 25.32,8.59 25.32,9.86 25.82,10.36 U5.2
$1N2071: length 20.1
  Top Layer w0.254: U5.4 24.48,11.87 26.82,11.87 27.36,12.41 v1(27.36,12.52) ; v1(32.82,4.65) 32.82,5.28 33.27,5.74 33.27,6.72 R15.2 32.77,7.5 R14.1
  Inner1 w0.254: v1(32.82,4.65) 33.12,4.95 33.12,8.2 29.58,11.74 28.64,11.74 27.86,12.52 v1(27.36,12.52)
$1N2073: length 3
  Top Layer w0.508: U5.6 23.91,9.4 23.56,9.4 23.24,9.08 23.24,8.33 23.75,7.82 C19.2
$1N4096: length 1.9
  Top Layer w0.254: R22.1 26.21,6.17 LED1.2
$1N4567: length 3.4
  Bottom Layer w0.254: LED2.2 22.92,4.82 22.92,5.66
$1N4859: length 27.9
  Inner2 w0.254: v1(20.52,19.81) 20.82,19.51 21.64,19.51 23.71,21.58 28.33,21.58 29.14,20.78 29.14,15.69 33.76,11.07 33.76,10.63 v1(34.45,9.94)
  Bottom Layer w0.254: v1(34.45,9.94) 34.54,9.85 R25.2 ; R26.1 R24.2 20.55,19.78 v1(20.52,19.81)
$1N15368: length 4.1
  Bottom Layer w0.254: LED3.2 33.16,3.03 31.03,5.17 R31.1
$2N1901: length 11.8
  Top Layer w0.254: Q2.1 8.38,10.25 v1(8.89,9.75)
  Bottom Layer w0.254: v1(8.89,9.75) 9.04,9.9 12.09,9.9 12.11,9.92 12.12,9.92 12.29,10.09 12.29,10.1 13.3,11.11 14.28,11.11 15.29,12.12 15.29,12.45 16,13.16 R4.2
$2N1906: length 25.8
  Top Layer w0.254: Q3.1 15.57,16.1 v1(14.75,15.28)
  Inner1 w0.254: v1(14.75,15.28) 13.8,15.28 13.26,14.74 13.26,12.14 9.83,8.71 8.89,8.71 v1(8.64,8.97)
  Bottom Layer w0.254: R6.2 18.16,13.22 17.04,12.1 17.04,10.11 15.99,9.05 13.87,9.05 13.02,8.2 11.04,8.2 10.55,8.69 8.79,8.69 8.64,8.84 v1(8.64,8.97)
$2N1991: length 8.4
  Top Layer w0.254: v1(20.2,13.45) 20.01,13.27 Q1.1
  Inner1 w0.254: v1(20.2,13.45) 14.89,13.45 v1(13.84,14.5)
  Bottom Layer w0.254: R2.2 v1(13.84,14.5)
$2N2000: length 13.6
  Top Layer w0.254: v1(15.98,21.75) 15.98,21.98 15.57,22.39
  Bottom Layer w0.254: 18.15,10.41 18.15,10.42 ; R5.2 18.87,11.14 18.87,15.88 15.98,18.77 v1(15.98,21.75)
$2N2001: length 20.4
  Top Layer w0.254: v1(5.51,17.53) 5.81,17.82 8.38,17.82
  Inner1 w0.254: v1(9.59,9.29) 9.59,9.88 8.33,11.13 8.33,14.71 v1(5.51,17.53)
  Bottom Layer w0.254: R3.2 15.23,9.65 13.97,9.65 12.9,8.59 11.16,8.59 10.45,9.29 v1(9.59,9.29)
$2N2002: length 16.9
  Top Layer w0.254: v1(19.32,6.53) Q1.6
  Inner1 w0.254: v1(19.32,6.53) 18.31,5.51 15.14,5.51 14.72,5.09 14.72,3.95 14.38,3.61 13.89,3.61 13.55,3.95 13.55,7.47 v1(11.85,9.17)
  Bottom Layer w0.254: v1(11.85,9.17) 12.98,9.17 13.84,10.03
$2N2874: length 5.3
  Top Layer w0.254: 40.69,14.81 40.31,14.81 39.68,14.17 Q6.1
  Bottom Layer w0.254: v1(40.79,14.91) 40.94,15.06 40.94,16.26 41.66,16.97 R21.2
$2N2880: length 21.9
  Top Layer w0.254: v1(47.62,20.07) 46.74,19.18 Q5.1
  Inner1 w0.254: v1(41.01,12.82) 41.62,12.82 42.63,13.83 42.63,18.01 44.68,20.07 v1(47.62,20.07)
  Bottom Layer w0.254: v1(41.01,12.82) 39.68,12.82 38.79,13.71 38.79,16.32 39.5,17.04 R19.2
$2N2881: length 2.3
  Top Layer w0.254: Q4.1 36.1,16.24 v1(36.1,16.22)
  Bottom Layer w0.254: R17.2 37.34,17.46 v1(36.1,16.22)
$2N2957: length 16.7
  Top Layer w0.254: Q6.6 40.5,6.52 v1(40.5,4.77)
  Inner1 w0.254: v1(34.92,11.19) 35.67,11.19 40.5,6.37 v1(40.5,4.77)
  Bottom Layer w0.254: R20.2 37.34,12.58 35.95,11.19 v1(34.92,11.19)
$2N2960: length 10.2
  Top Layer w0.254: v1(47.5,12.06) 46.92,11.48 Q5.6
  Bottom Layer w0.254: v1(47.5,12.06) 46.16,13.4 39.75,13.4 39.5,13.66 R18.2
$2N2963: length 19.2
  Top Layer w0.254: v1(35.18,23.18) 35.18,23.08 35.87,22.39
  Inner1 w0.254: v1(41.69,14.22) 41.69,21.37 41.12,21.94 41.12,24.92 40.47,25.57 37.57,25.57 v1(35.18,23.18)
  Bottom Layer w0.254: v1(41.69,14.22) 41.66,14.22 R16.2

## Copper pours and planes (outline as drawn; the poured copper is in the pictures)
3.3V on Top Layer: 27.52,9.63 29.72,9.63 30.21,10.12 33.24,10.12 33.24,10.91 27.69,10.91 27.52,10.73
GND on Top Layer: -0.84,36.02 55.81,36.02 55.81,-7.29 -0.84,-7.29
GND on Bottom Layer: -1.34,34.24 57.97,34.24 57.97,-3.48 -1.34,-3.48
GND on Inner1: -7.44,33.86 56.82,33.86 56.82,-4.37 -7.44,-4.37
GND on Inner2: -7.82,38.43 60.12,38.43 60.12,-9.7 -7.82,-9.7
VIN on Top Layer: 23.55,29.67 23.55,18.62 23.42,18.49 16.69,18.49 16.47,18.27 16.47,16.2 14.09,13.81 9.27,13.81 9.27,11.3 9.57,11.6 18.5,11.6 18.5,14.35 27.82,14.35 29.9,12.27 34.44,12.27 35.22,11.48 38.78,11.48 38.78,13.92 40.57,15.7 45.97,15.7 45.97,18.29 36.84,18.29 36.84,16.03 36.5,15.7 31.16,15.7 27.49,19.36 27.49,29.63 27.45,29.67
VIN on Top Layer: 21.21,14.99 21.21,10.06 24.78,10.06 25.73,11.02 26.89,11.02 26.92,11.05 26.92,11.61 25.44,11.61 24.63,10.8 22.93,10.8 22.93,14.99
L_VS1_N on Top Layer: 7.79,8.89 6.18,10.5 0.03,10.5 0.03,7.59 0.13,7.49 4.78,7.49 6.86,5.41 7.79,5.41
L_VS1_P on Top Layer: 14.02,11.1 12.71,9.6 12.71,7.03 14.01,7.03 14.01,7.41 14.99,8.38 19.86,8.38 19.86,11.1
L_VS2 on Top Layer: 0.46,16.83 0,16.37 0,13.72 0.64,13.08 6.86,13.08 7.87,14.1 12.86,14.1 12.86,16.83
L_VS3_N on Top Layer: 6.41,24.58 4.45,22.61 0,22.61 0,19.37 6.12,19.37 7.81,21.05 7.81,24.58
L_VS3_P on Top Layer: 15.37,21.34 14.22,22.49 14.22,24.82 12.79,24.82 12.79,20.32 14.25,18.67 20.05,18.67 20.05,21.28 19.99,21.34
R_VS1_N on Top Layer: 47.21,24.64 48.64,24.64 50.67,22.61 54.89,22.61 54.89,19.48 48.97,19.48 47.21,21.24
R_VS1_P on Top Layer: 39.9,21.34 41.25,22.68 42.41,22.68 42.41,20.25 40.82,18.67 35.31,18.67 35.31,21.34
R_VS2 on Top Layer: 42.42,15.21 47.47,15.21 49.02,16.76 54.36,16.76 54.94,16.18 55,16.18 55,13.22 54.36,12.57 42.42,12.57 42.42,15.04
R_VS3_N on Top Layer: 47.24,8.85 48.48,8.85 50.04,10.41 54.89,10.41 54.89,7.44 50.62,7.44 48.57,5.39 47.24,5.39
R_VS3_P on Top Layer: 35.31,11.05 40.97,11.05 42.4,9.62 42.4,7.04 41.18,7.04 39.87,8.36 35.33,8.36 35.31,8.38
$1N2066 on Top Layer: 25.41,7.39 29.72,7.39 29.72,8.45 27.47,8.45 27.28,8.25 25.41,8.25

Small or netless copper shapes (teardrops, artwork), in the pictures only: 97 on Top Layer, 193 on Bottom Layer, 53 on Inner1, 7 on Inner2

## Text on the board
Bottom Silkscreen Layer: RIGHT | LEFT | L / ERR | R / ERR | 3V3 | CLK | DI | DO | CS | GND | CAN_TX | CAN_RX | TX | RX
Top Silkscreen Layer: CH32V203 / DOUBLE-FOC / —V0.1 | GND | VIN | PWR | RST | KEY | 3.3V | CLK | DIO | B | C | A
